# Altium schematic sheet Differential_Noise_Generator.SchDoc: Differentiel Signal Generator - Differential Generator
size A4; Author: Philippe Groulx-Létourneau; DrawnBy: Philippe Groulx-Létourneau; SheetNumber: 4; SheetTotal: 4; SPICEModelCacheOMMOXGID: <root> / <DocumentId>OMMOXGID</DocumentId> / </root>
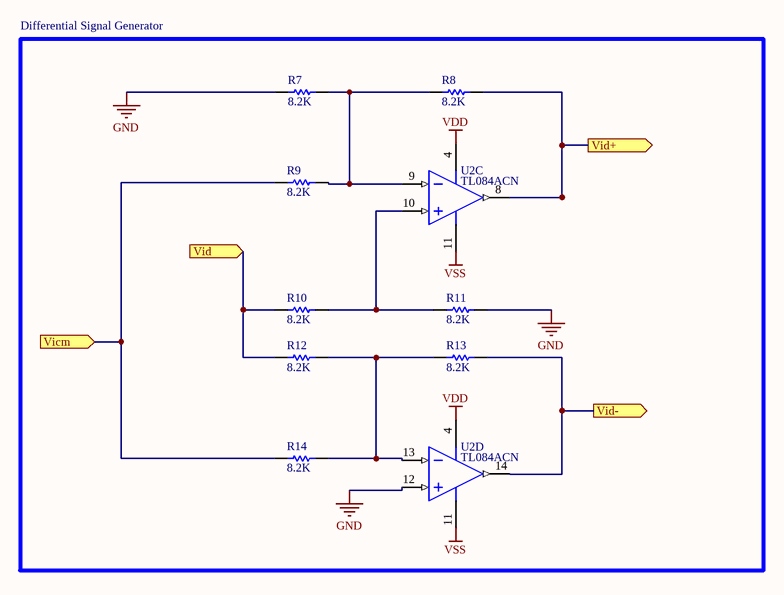
[diagram p0: Differential_Noise_Generator.SchDoc]

## Parts
R7  value 8.2K  [Resistor_Axial 0.4]  (hidden comment: Res1)
R8  value 8.2K  [Resistor_Axial 0.4]  (hidden comment: Res1)
R9  value 8.2K  [Resistor_Axial 0.4]  (hidden comment: Res1)
R10  value 8.2K  [Resistor_Axial 0.4]  (hidden comment: Res1)
R11  value 8.2K  [Resistor_Axial 0.4]  (hidden comment: Res1)
R12  value 8.2K  [Resistor_Axial 0.4]  (hidden comment: Res1)
R13  value 8.2K  [Resistor_Axial 0.4]  (hidden comment: Res1)
R14  value 8.2K  [Resistor_Axial 0.4]  (hidden comment: Res1)
U2  TL084ACN  [N0014A]  (parts C,D of 4)

## Blocks framed on the sheet
Differential Signal Generator: R7-R14 U2

## Ports
Vicm (in, see Filtre_PWM60Hz[4B]), Vid (in, see Filtre_PWM1kHz[4B]), Vid+ (out, see Generator_main[2A]), Vid- (out, see Generator_main[2A])

## Nets
GND: R7.1 R11.2 U2.12(IN4+)
VDD: U2.4(VCC+)
VSS: U2.11(VCC-)
Vicm: R9.1 R14.1 ; port Vicm
Vid: R10.1 R12.1 ; port Vid
Vid+: R8.2 U2.8(OUT3) ; port Vid+
Vid-: R13.2 U2.14(OUT4) ; port Vid-
NetR7_2: R7.2 R8.1 R9.2 U2.9(IN3-)
NetR10_2: R10.2 R11.1 U2.10(IN3+)
NetR12_2: R12.2 R13.1 R14.2 U2.13(IN4-)

## Library data of the parts
R7-R14 = Res1: Resistor; Published: 8-Jun-2000; LatestRevisionDate: 17-Jul-2002; LatestRevisionNote: Re-released for DXP Platform.; PackageReference: AXIAL-0.3; Publisher: Altium Limited; PackageDescription: Axial Device, Thru-Hole; 2 Leads; 0.3 in Pin Spacing
U2 = CMP-0017-00814-2: JFET-Input Operational Amplifier, 7 to 36 V, 0 to 70 degC, 14-pin DIP (N14), Pb-Free (RoHS); Manufacturer: Texas Instruments; Sub Family: General Purpose Amplifier, High Supply Voltage Amplifier (>=30V); Slew Rate(Typ)(V/us): 13; Offset Drift(Typ)(uV/C): 18; GBW(Typ)(MHz): 3; Number of Channels: 4; Rating: Catalog; Total Supply Voltage(Max)(+5V is 5, +/-5V is 10): 36; Vio (25C)(Max)(mV): 6; IIB(Max)(pA): 200; CMRR(Min)(dB): 75; Total Supply Voltage(Min)(+5V is 5, +/-5V is 10): 7; Iq per channel(Max)(mA): 2.8; PackageReference: N0014A; ComponentLink1Description: Manufacturer URL; ComponentLink1URL: http://www.ti.com/; Code_JEDEC: MS-001; PackageVersion: 4040049/E, 12/2002; Mounting Technology: Through Hole; PackageDescription: 14-Pin Plastic In-Line, Body 19.305 x 6.35 mm, Pitch 2.54 mm; ComponentLink2URL: http://www.ti.com/lit/ds/symlink/tl084a.pdf; Vn at 1kHz(Typ)(nV/rtHz): 18; DatasheetVersion: SLOS081G; ComponentLink3Description: Package Specification; ComponentLink3URL: http://www.ti.com/lit/ml/mpdi002c/mpdi002c.pdf; PartNumber: TL084ACN; Eco-Plan: Pb-Free (RoHS); ComponentLink2Description: Datasheet